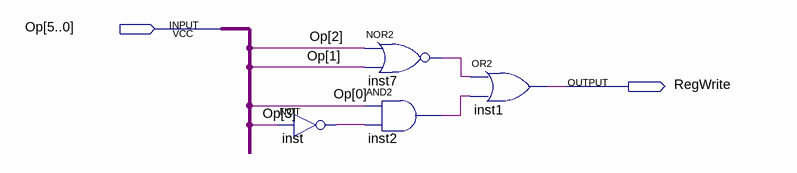
[diagram p0: schematic sheet]
// Quartus schematic RegWriteDecoder.bdf as structural Verilog: 4 symbols, 2 pins
module RegWriteDecoder (
  input  [5:0] Op,
  output RegWrite
);

  wire inst2_out, inst7_out, inst_out;

  not inst (inst_out, Op[3]);
  nor inst7 (inst7_out, Op[2], Op[1]);
  and inst2 (inst2_out, Op[0], inst_out);
  or inst1 (RegWrite, inst7_out, inst2_out);
endmodule
